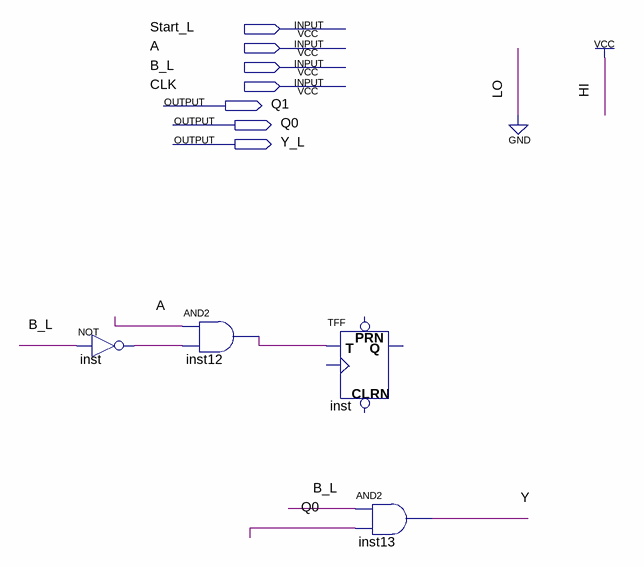
[diagram p0: schematic sheet]
// Quartus schematic Practical1.bdf as structural Verilog: 4 symbols, 7 pins
module Practical1 (
  input  Start_L,
  input  A,
  input  B_L,
  input  CLK,
  output Q1,
  output Q0,
  output Y_L
);

  wire inst12_out, inst_out, Y;

  not inst (inst_out, B_L);
  and inst12 (inst12_out, A, inst_out);
  TFF inst_dup2 (.T(inst12_out));  // open: PRN, CLRN, CLK, Q
  and inst13 (Y, B_L, Q0);
endmodule
